# Altium project SpsctrumCharacteristicTester.PrjPCB
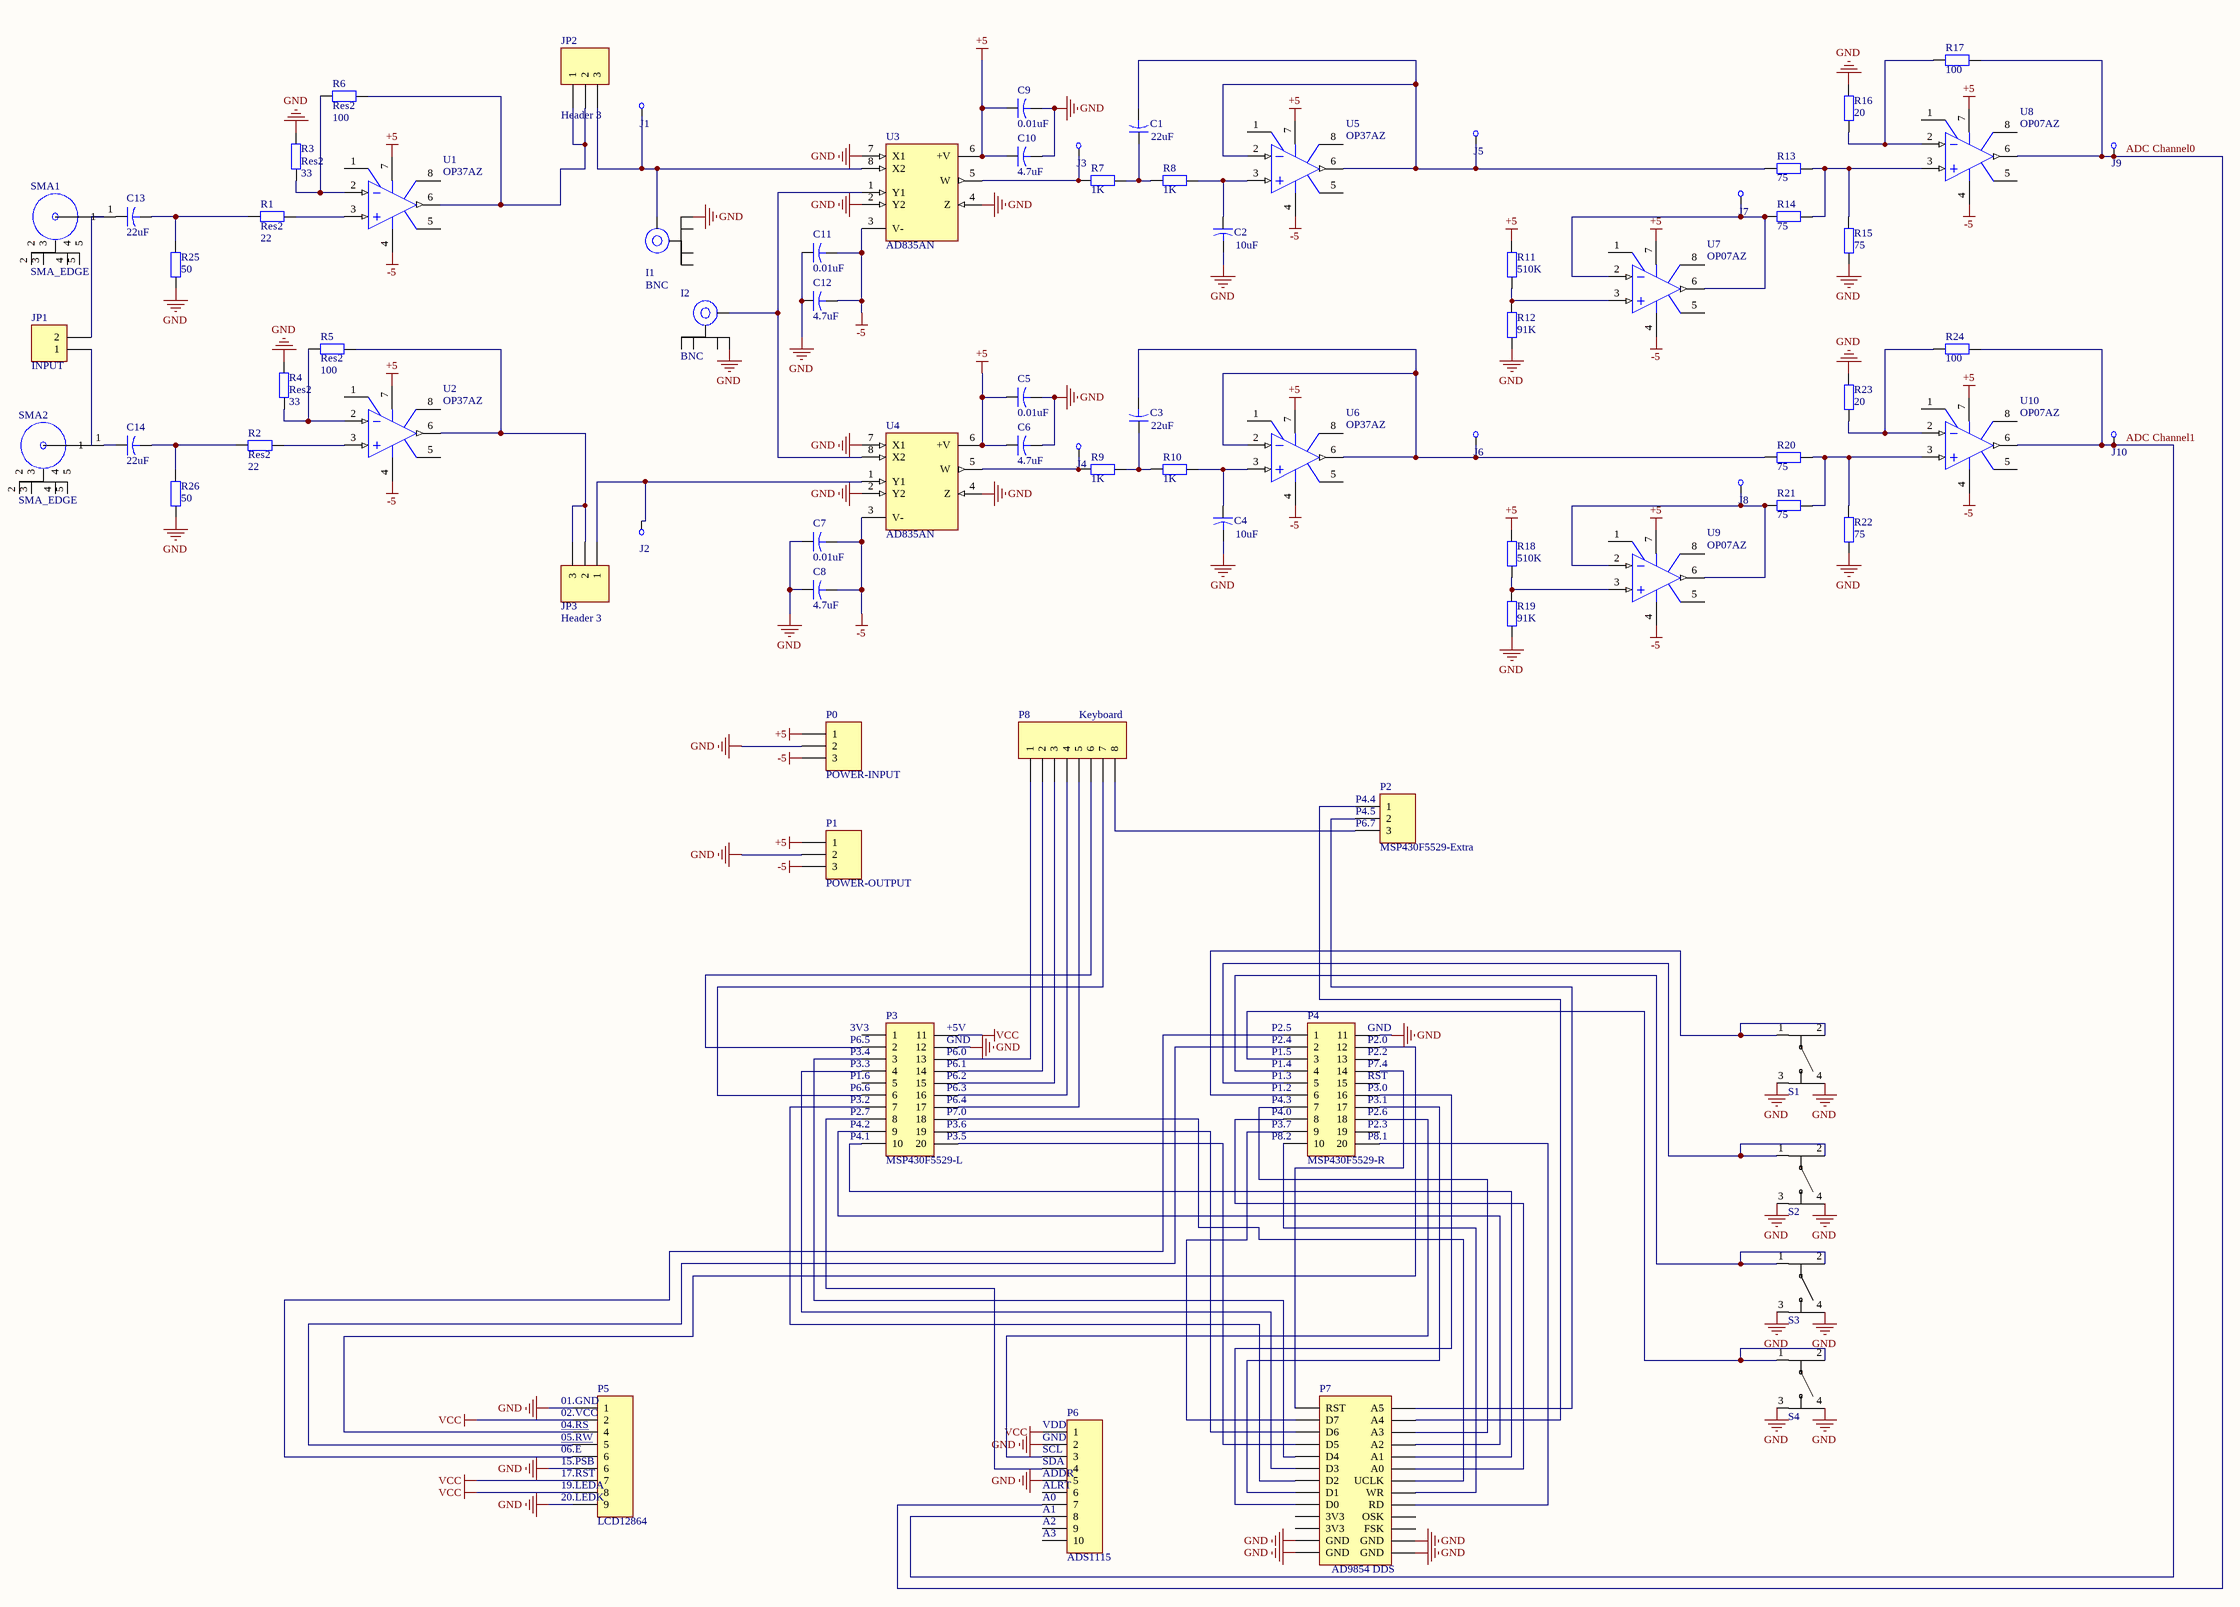
[diagram p0: SpsctrumCharacteristicTester.SchDoc]
1 sheet, 80 parts. Net scope: global (net labels, ports and power ports of the same name join across sheets).
Board file: SpsctrumCharacteristicTester.PcbDoc

## Sheet SpsctrumCharacteristicTester.SchDoc
size A2

### Parts
C1  value 22uF  [CAPR5-4X5]  (hidden comment: Cap2)
C2  value 10uF  [CAPR5-4X5]  (hidden comment: Cap2)
C3  value 22uF  [CAPR5-4X5]  (hidden comment: Cap2)
C4  value 10uF  [CAPR5-4X5]  (hidden comment: Cap2)
C5  value 0.01uF  [CAPR5-4X5]  (hidden comment: Cap2)
C6  value 4.7uF  [CAPR5-4X5]  (hidden comment: Cap2)
C7  value 0.01uF  [CAPR5-4X5]  (hidden comment: Cap2)
C8  value 4.7uF  [CAPR5-4X5]  (hidden comment: Cap2)
C9  value 0.01uF  [CAPR5-4X5]  (hidden comment: Cap2)
C10  value 4.7uF  [CAPR5-4X5]  (hidden comment: Cap2)
C11  value 0.01uF  [CAPR5-4X5]  (hidden comment: Cap2)
C12  value 4.7uF  [CAPR5-4X5]  (hidden comment: Cap2)
C13  value 22uF  [CAPR5-4X5]  (hidden comment: Cap2)
C14  value 22uF  [CAPR5-4X5]  (hidden comment: Cap2)
I1  BNC  [BNC-KWE]
I2  BNC  [BNC-KWE]
J1  CHECK  [CHECK-A]  (value not drawn)
J2  CHECK  [CHECK-A]  (value not drawn)
J3  CHECK  [CHECK-A]  (value not drawn)
J4  CHECK  [CHECK-A]  (value not drawn)
J5  CHECK  [CHECK-A]  (value not drawn)
J6  CHECK  [CHECK-A]  (value not drawn)
J7  CHECK  [CHECK-A]  (value not drawn)
J8  CHECK  [CHECK-A]  (value not drawn)
J9  CHECK  [CHECK-A]  (value not drawn)
J10  CHECK  [CHECK-A]  (value not drawn)
JP1  INPUT  [HDR1X2]
JP2  Header 3  [HDR1X3]
JP3  Header 3  [HDR1X3]
P0  POWER-INPUT  [HDR1X3]
P1  POWER-OUTPUT  [HDR1X3]
P2  MSP430F5529-Extra  [HDR1X3]
P3  MSP430F5529-L  [HDR2X10_CEN]
P4  MSP430F5529-R  [HDR2X10_CEN]
P5  LCD12864  [HDR1X9]
P6  ADS1115  [HDR1X10]
P7  (no value)  [IDC-26]
P8  Keyboard  [HDR1X8]
R1  Res2  value 22  [AXIAL-0.4]
R2  Res2  value 22  [AXIAL-0.4]
R3  Res2  value 33  [AXIAL-0.4]
R4  Res2  value 33  [AXIAL-0.4]
R5  Res2  value 100  [AXIAL-0.4]
R6  Res2  value 100  [AXIAL-0.4]
R7  value 1K  [AXIAL-0.4]  (hidden comment: Res2)
R8  value 1K  [AXIAL-0.4]  (hidden comment: Res2)
R9  value 1K  [AXIAL-0.4]  (hidden comment: Res2)
R10  value 1K  [AXIAL-0.4]  (hidden comment: Res2)
R11  value 510K  [AXIAL-0.4]  (hidden comment: Res2)
R12  value 91K  [AXIAL-0.4]  (hidden comment: Res2)
R13  value 75  [AXIAL-0.4]  (hidden comment: Res2)
R14  value 75  [AXIAL-0.4]  (hidden comment: Res2)
R15  value 75  [AXIAL-0.4]  (hidden comment: Res2)
R16  value 20  [AXIAL-0.4]  (hidden comment: Res2)
R17  value 100  [AXIAL-0.4]  (hidden comment: Res2)
R18  value 510K  [AXIAL-0.4]  (hidden comment: Res2)
R19  value 91K  [AXIAL-0.4]  (hidden comment: Res2)
R20  value 75  [AXIAL-0.4]  (hidden comment: Res2)
R21  value 75  [AXIAL-0.4]  (hidden comment: Res2)
R22  value 75  [AXIAL-0.4]  (hidden comment: Res2)
R23  value 20  [AXIAL-0.4]  (hidden comment: Res2)
R24  value 100  [AXIAL-0.4]  (hidden comment: Res2)
R25  value 50  [AXIAL-0.4]  (hidden comment: Res2)
R26  value 50  [AXIAL-0.4]  (hidden comment: Res2)
S1  6*6 微动开关  [6*6微动开关]  (value not drawn)
S2  6*6 微动开关  [6*6微动开关]  (value not drawn)
S3  6*6 微动开关  [6*6微动开关]  (value not drawn)
S4  6*6 微动开关  [6*6微动开关]  (value not drawn)
SMA1  SMA_EDGE  [SMA_EDGE]
SMA2  SMA_EDGE  [SMA_EDGE]
U1  OP37AZ  [Q-8]
U2  OP37AZ  [Q-8]
U3  AD835AN  [N-8_A]
U4  AD835AN  [N-8_A]
U5  OP37AZ  [Q-8]
U6  OP37AZ  [Q-8]
U7  OP07AZ  [Q-8]
U8  OP07AZ  [Q-8]
U9  OP07AZ  [Q-8]
U10  OP07AZ  [Q-8]

### Nets
+5: C5.1 C6.1 C9.1 C10.1 P0.1 P1.1 R11.2 R18.2 U1.7(V+) U2.7(V+) U3.6(+V) U4.6(+V) U5.7(V+) U6.7(V+) U7.7(V+) U8.7(V+) U9.7(V+) U10.7(V+)
-5: C7.2 C8.2 C11.2 C12.2 P0.3 P1.3 U1.4(V-) U2.4(V-) U3.3(V-) U4.3(V-) U5.4(V-) U6.4(V-) U7.4(V-) U8.4(V-) U9.4(V-) U10.4(V-)
GND: C2.2 C4.2 C5.2 C6.2 C7.1 C8.1 C9.2 C10.2 C11.1 C12.1 I1.5 I2.5 P0.2 P1.2 P3.12 P4.11 P5.1 P5.6 P5.9 P6.2 P6.5 P7.23(GND) P7.24(GND) P7.25(GND) P7.26(GND) R3.2 R4.2 R12.1 R15.1 R16.1 R19.1 R22.1 R23.1 R25.1 R26.1 S1.3 S1.4 S2.3 S2.4 S3.3 S3.4 S4.3 S4.4 U3.2(Y2) U3.4(Z) U3.7(X1) U4.2(Y2) U4.4(Z) U4.7(X1)
VCC: P3.11 P5.2 P5.7 P5.8 P6.1
ADC Channel0: J9.1 P6.7 R17.2 U8.6(OUT)
ADC Channel1: J10.1 P6.8 R24.2 U10.6(OUT)
NetC1_1: C1.1 R7.2 R8.1
NetC1_2: C1.2 J5.1 R13.1 U5.2(IN-) U5.6(OUT)
NetC2_1: C2.1 R8.2 U5.3(IN+)
NetC3_1: C3.1 R9.2 R10.1
NetC3_2: C3.2 J6.1 R20.1 U6.2(IN-) U6.6(OUT)
NetC4_1: C4.1 R10.2 U6.3(IN+)
NetC13_1: C13.1 SMA1.1
NetC13_2: C13.2 R1.1 R25.2
NetC14_1: C14.1 SMA2.1
NetC14_2: C14.2 R2.1 R26.2
NetI1_1: I1.1 J1.1 JP2.3 U3.8(X2)
NetI2_1: I2.1 U3.1(Y1) U4.8(X2)
NetJ2_1: J2.1 JP3.1 U4.1(Y1)
NetJ3_1: J3.1 R7.1 U3.5(W)
NetJ4_1: J4.1 R9.1 U4.5(W)
NetJ7_1: J7.1 R14.1 U7.2(IN-) U7.6(OUT)
NetJ8_1: J8.1 R21.1 U9.2(IN-) U9.6(OUT)
NetJP2_1: JP2.1 JP2.2 R6.1 U1.6(OUT)
NetJP3_2: JP3.2 JP3.3 R5.1 U2.6(OUT)
NetP2_1: P2.1 P7.4(A4)
NetP2_2: P2.2 P7.2(A5)
NetP2_3: P2.3 P8.8
NetP3_2: P3.2 P8.6
NetP3_3: P3.3 P7.9(D4)
NetP3_4: P3.4 P7.11(D3)
NetP3_6: P3.6 P8.7
NetP3_7: P3.7 P7.13(D2)
NetP3_8: P3.8 P6.4
NetP3_9: P3.9 P7.8(A2)
NetP3_10: P3.10 P7.10(A1)
NetP3_13: P3.13 P8.1
NetP3_14: P3.14 P8.2
NetP3_15: P3.15 P8.3
NetP3_16: P3.16 P8.4
NetP3_17: P3.17 P8.5
NetP3_18: P3.18 P7.14(UCLK)
NetP3_19: P3.19 P7.5(D6)
NetP3_20: P3.20 P7.7(D5)
NetP4_1: P4.1 P5.6
NetP4_2: P4.2 P5.5
NetP4_3: P4.3 S4.1 S4.2
NetP4_4: P4.4 S3.1 S3.2
NetP4_5: P4.5 S2.1 S2.2
NetP4_6: P4.6 S1.1 S1.2
NetP4_7: P4.7 P7.6(A3)
NetP4_8: P4.8 P7.12(A0)
NetP4_9: P4.9 P7.3(D7)
NetP4_10: P4.10 P7.16(WR)
NetP4_12: P4.12 P5.4
NetP4_14: P4.14 P7.1(RST)
NetP4_16: P4.16 P7.17(D0)
NetP4_17: P4.17 P7.15(D1)
NetP4_18: P4.18 P6.3
NetP4_20: P4.20 P7.18(RD)
NetR1_2: R1.2 U1.3(IN+)
NetR2_2: R2.2 U2.3(IN+)
NetR3_1: R3.1 R6.2 U1.2(IN-)
NetR4_1: R4.1 R5.2 U2.2(IN-)
NetR11_1: R11.1 R12.2 U7.3(IN+)
NetR13_2: R13.2 R14.2 R15.2 U8.3(IN+)
NetR16_2: R16.2 R17.1 U8.2(IN-)
NetR18_1: R18.1 R19.2 U9.3(IN+)
NetR20_2: R20.2 R21.2 R22.2 U10.3(IN+)
NetR23_2: R23.2 R24.1 U10.2(IN-)

Not connected (* = marked no-connect by the designer): I1 2 3 4; I2 2 3 4; JP1 1 2; P3 1 5; P4 13 15 19; P6 6 9 10; P7 19(3V3) 20(OSK) 21(3V3) 22(FSK); SMA1 2 3 4 5; SMA2 2 3 4 5; U1 1(VOSTRIM) 5(NC) 8(VOSTRIM); U2 1(VOSTRIM) 5(NC) 8(VOSTRIM); U5 1(VOSTRIM) 5(NC) 8(VOSTRIM); U6 1(VOSTRIM) 5(NC) 8(VOSTRIM); U7 1(VOSTRIM) 5(NC) 8(VOSTRIM); U8 1(VOSTRIM) 5(NC) 8(VOSTRIM); U9 1(VOSTRIM) 5(NC) 8(VOSTRIM); U10 1(VOSTRIM) 5(NC) 8(VOSTRIM)

### Notes on the sheet
- (near P2) P4.4
- (near P2) P4.5
- (near P2) P6.7
- (near P3) 3V3
- (near P3) P6.5
- (near P3) P3.4
- (near P3) P3.3
- (near P3) P1.6
- (near P3) +5V
- (near P3) GND
- (near P3) P6.0
- (near P3) P6.1
- (near P3) P6.2
- (near P4) P2.5
- (near P4) P2.4
- (near P4) P1.5
- (near P4) P1.4
- (near P4) P1.3
- (near P4) GND
- (near P4) P2.0
- (near P4) P2.2
- (near P4) P7.4
- (near P4) RST
- (near P3) P6.6
- (near P3) P3.2
- (near P3) P2.7
- (near P3) P4.2
- (near P3) P4.1
- (near P3) P6.3
- (near P3) P6.4
- (near P3) P7.0
- (near P3) P3.6
- (near P3) P3.5
- (near P4) P1.2
- (near P4) P4.3
- (near P4) P4.0
- (near P4) P3.7
- (near P4) P8.2
- (near P4) P3.0
- (near P4) P3.1
- (near P4) P2.6
- (near P4) P2.3
- (near P4) P8.1
- (near P5) 01.GND
- (near P5) 02.VCC
- (near P5) 04.RS <http://04.RS>
- (near P5) 05.RW <http://05.RW>
- (near P6) VDD
- (near P6) GND
- (near P5) 06.E
- (near P5) 15.PSB
- (near P5) 17.RST
- (near P5) 19.LEDA
- (near P5) 20.LEDK
- (near P6) SCL
- (near P6) SDA
- (near P6) ADDR
- (near P6) ALRT
- (near P6) A0
- (near P6) A1
- (near P6) A2
- (near P6) A3

### Library data of the parts
C1-C14 = Cap2: Capacitor; Published: 23-Sep-2002; PackageReference: CAPR5-4X5; Publisher: Altium Limited
J1-J10 = CHECK: 测试点
JP1 = Header 2: Header, 2-Pin; LatestRevisionDate: 17-Jul-2002; LatestRevisionNote: Re-released for DXP Platform.; Publisher: Altium Limited
JP2 JP3 P0-P2 = Header 3: Header, 3-Pin; LatestRevisionDate: 17-Jul-2002; LatestRevisionNote: Re-released for DXP Platform.; Publisher: Altium Limited
P3 P4 = Header 10X2A: Header, 10-Pin, Dual row; LatestRevisionDate: 17-Jul-2002; LatestRevisionNote: Re-released for DXP Platform.; Publisher: Altium Limited
P5 = Header 9: Header, 9-Pin; LatestRevisionDate: 17-Jul-2002; LatestRevisionNote: Re-released for DXP Platform.; Publisher: Altium Limited
P6 = Header 10: Header, 10-Pin; LatestRevisionDate: 17-Jul-2002; LatestRevisionNote: Re-released for DXP Platform.; Publisher: Altium Limited
P7 = AD9854 DDS
P8 = Header 8: Header, 8-Pin; LatestRevisionDate: 17-Jul-2002; LatestRevisionNote: Re-released for DXP Platform.; Publisher: Altium Limited
R1-R26 = Res2: Resistor; Published: 8-Jun-2000; LatestRevisionDate: 17-Jul-2002; LatestRevisionNote: Re-released for DXP Platform.; PackageReference: AXIAL-0.4; Publisher: Altium Limited
SMA1 SMA2 = SMA_EDGE: SMA接口
U1 U2 U5 U6 = OP37AZ: Low-Noise, Precision, High-Speed Operational Amplifier (Avcl >= 5); Note: Pin 5 is not connected.; Published: 8-Jun-2000; LatestRevisionDate: 04-Mar-2005; LatestRevisionNote: Stylized 3D Model Added.; DatasheetVersion: 1992; PackageVersion: 1998; PackageReference: Q-8; Publisher: Altium Limited; PackageDescription: DIP; 8 Leads; Row Spacing 7.62 mm; Pitch 2.54 mm; ComponentLink1Description: Manufacturer Link; ComponentLink1URL: http://www.analog.com/en/prod/0,,759_786_OP37%2C00.html; ComponentLink2Description: Datasheet; ComponentLink2URL: http://www.analog.com/UploadedFiles/Data_Sheets/5021673OP37_b.pdf
U3 U4 = AD835AN: 250MHz, Voltage Output 4-Quadrant Multiplier; Published: 8-Jun-2000; LatestRevisionDate: 04-Mar-2005; LatestRevisionNote: Stylized 3D Model Added.; DatasheetVersion: REV.A 1998; PackageReference: N-8_A; Publisher: Altium Limited; PackageDescription: DIP; 8 Leads; Row Spacing 7.62 mm; Pitch 2.54 mm; Code_JEDEC: MO-001-AN; ComponentLink1Description: Manufacturer Link; ComponentLink1URL: http://www.analog.com/en/prod/0%2C2877%2CAD835%2C00.html; ComponentLink2Description: Datasheet; ComponentLink2URL: http://www.analog.com/UploadedFiles/Data_Sheets/3399848488427AD835_b.pdf
U7-U10 = OP07AZ: Ultra-Low Offset Voltage Operational Amplifier; Note: Pin 5 is not connected.; Published: 8-Jun-2000; LatestRevisionDate: 04-Mar-2005; LatestRevisionNote: Stylized 3D Model Added.; DatasheetVersion: 1992; PackageVersion: 1998; PackageReference: Q-8; Publisher: Altium Limited; PackageDescription: DIP; 8 Leads; Row Spacing 7.62 mm; Pitch 2.54 mm; ComponentLink1Description: Manufacturer Link; ComponentLink1URL: http://www.analog.com/en/prod/0,,759_786_OP07%2C00.html; ComponentLink2Description: Datasheet; ComponentLink2URL: http://www.analog.com/UploadedFiles/Data_Sheets/39161232478959OP07_c.pdf